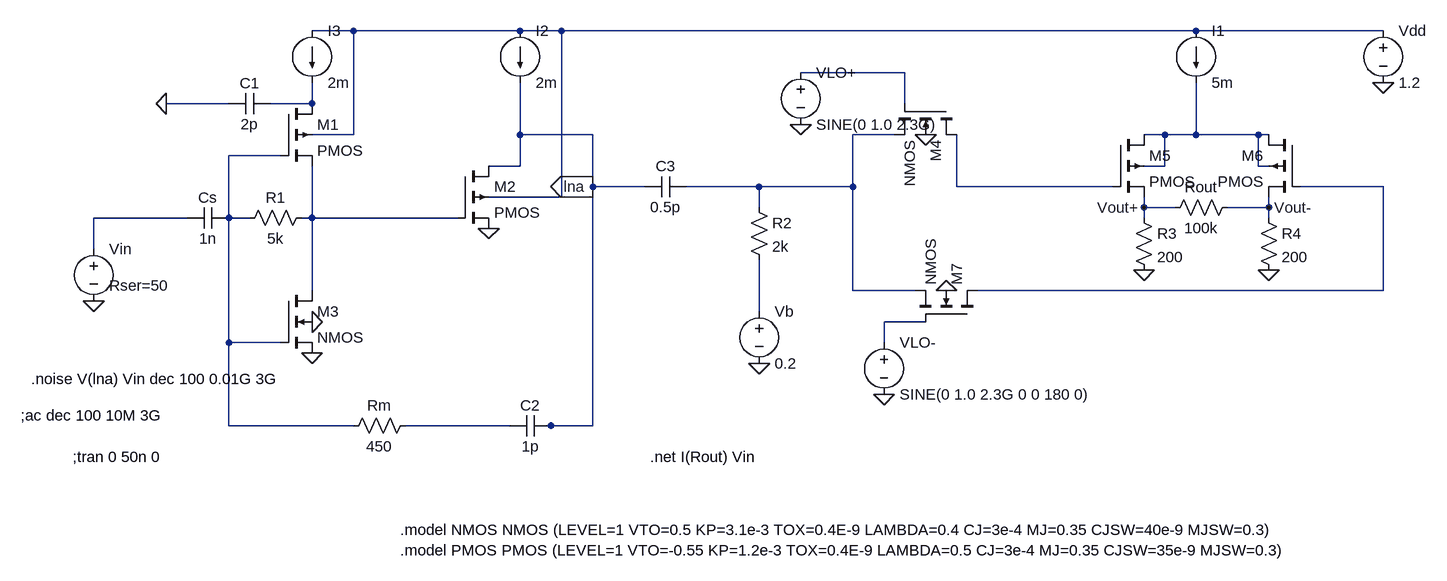
[diagram p0: schematic grad_noise.asc]
grad_noise.asc, the LTspice schematic file:
Version 4
SHEET 1 880 884
WIRE -912 48 -976 48
WIRE -656 48 -912 48
WIRE -592 48 -656 48
WIRE 384 48 -592 48
WIRE 672 48 384 48
WIRE -64 112 -224 112
WIRE -1104 160 -1200 160
WIRE -976 160 -976 128
WIRE -976 160 -1040 160
WIRE -64 160 -64 112
WIRE -912 208 -912 48
WIRE -912 208 -976 208
WIRE -656 208 -656 128
WIRE -544 208 -656 208
WIRE -80 208 -144 208
WIRE 336 208 304 208
WIRE 384 208 384 128
WIRE 384 208 336 208
WIRE 480 208 384 208
WIRE 496 208 480 208
WIRE -1024 240 -1104 240
WIRE -656 256 -656 208
WIRE -656 256 -704 256
WIRE 336 256 336 208
WIRE 336 256 304 256
WIRE 480 256 480 208
WIRE 496 256 480 256
WIRE -544 288 -544 208
WIRE -464 288 -544 288
WIRE -288 288 -400 288
WIRE -144 288 -144 208
WIRE -144 288 -288 288
WIRE 16 288 16 208
WIRE 256 288 16 288
WIRE 672 288 544 288
WIRE -592 304 -592 48
WIRE -592 304 -704 304
WIRE -288 320 -288 288
WIRE 304 320 304 304
WIRE 352 320 304 320
WIRE 496 320 496 304
WIRE 496 320 432 320
WIRE -1168 336 -1312 336
WIRE -1104 336 -1104 240
WIRE -1072 336 -1104 336
WIRE -976 336 -976 256
WIRE -976 336 -992 336
WIRE -752 336 -976 336
WIRE 304 336 304 320
WIRE 496 336 496 320
WIRE -1312 384 -1312 336
WIRE -976 448 -976 336
WIRE -144 448 -144 288
WIRE -48 448 -144 448
WIRE 672 448 672 288
WIRE 672 448 48 448
WIRE -288 480 -288 400
WIRE -32 496 -96 496
WIRE -1104 528 -1104 336
WIRE -1024 528 -1104 528
WIRE -96 528 -96 496
WIRE -1104 656 -1104 528
WIRE -912 656 -1104 656
WIRE -672 656 -832 656
WIRE -608 656 -624 656
WIRE -544 656 -544 288
WIRE -544 656 -608 656
FLAG 672 128 0
FLAG -1200 160 0
FLAG -704 352 0
FLAG -976 496 0
FLAG -976 544 0
FLAG -1312 464 0
FLAG -32 208 0
FLAG -224 192 0
FLAG -96 608 0
FLAG 304 416 0
FLAG 496 416 0
FLAG -288 560 0
FLAG 0 448 0
FLAG 304 320 Vout+
FLAG 496 320 Vout-
FLAG -544 288 lna
IOPIN -544 288 Out
SYMBOL voltage 672 32 R0
WINDOW 123 0 0 Left 0
WINDOW 39 0 0 Left 0
SYMATTR InstName Vdd
SYMATTR Value 1.2
SYMBOL current 384 48 R0
WINDOW 123 0 0 Left 0
WINDOW 39 0 0 Left 0
SYMATTR InstName I1
SYMATTR Value 5m
SYMBOL current -656 48 R0
WINDOW 123 0 0 Left 0
WINDOW 39 0 0 Left 0
SYMATTR InstName I2
SYMATTR Value 2m
SYMBOL current -976 48 R0
WINDOW 123 0 0 Left 0
WINDOW 39 0 0 Left 0
SYMATTR InstName I3
SYMATTR Value 2m
SYMBOL cap -1040 144 R90
WINDOW 0 0 32 VBottom 2
WINDOW 3 32 32 VTop 2
SYMATTR InstName C1
SYMATTR Value 2p
SYMBOL pmos4 -1024 160 R0
SYMATTR InstName M1
SYMATTR Value2 l=180n w=144u
SYMBOL res -976 320 R90
WINDOW 0 0 56 VBottom 2
WINDOW 3 32 56 VTop 2
SYMATTR InstName R1
SYMATTR Value 5k
SYMBOL pmos4 -752 256 R0
SYMATTR InstName M2
SYMATTR Value2 l=180n w=14.4u
SYMBOL nmos4 -1024 448 R0
SYMATTR InstName M3
SYMATTR Value2 l=180n w=5.4u
SYMBOL res -816 640 R90
WINDOW 0 0 56 VBottom 2
WINDOW 3 32 56 VTop 2
SYMATTR InstName Rm
SYMATTR Value 450
SYMBOL cap -608 640 R90
WINDOW 0 0 32 VBottom 2
WINDOW 3 32 32 VTop 2
SYMATTR InstName C2
SYMATTR Value 1p
SYMBOL cap -400 272 R90
WINDOW 0 0 32 VBottom 2
WINDOW 3 32 32 VTop 2
SYMATTR InstName C3
SYMATTR Value 0.5p
SYMBOL res -304 304 R0
SYMATTR InstName R2
SYMATTR Value 2k
SYMBOL cap -1104 320 R90
WINDOW 0 0 32 VBottom 2
WINDOW 3 32 32 VTop 2
SYMATTR InstName Cs
SYMATTR Value 1n
SYMBOL nmos4 16 160 R90
SYMATTR InstName M4
SYMATTR Value2 l=180n w=900n
SYMBOL voltage -224 96 R0
WINDOW 123 0 0 Left 0
WINDOW 39 0 0 Left 0
SYMATTR InstName VLO+
SYMATTR Value SINE(0 1.0 2.3G)
SYMBOL voltage -96 512 R0
WINDOW 123 0 0 Left 0
WINDOW 39 0 0 Left 0
SYMATTR InstName VLO-
SYMATTR Value SINE(0 1.0 2.3G 0 0 180 0)
SYMBOL pmos4 256 208 R0
SYMATTR InstName M5
SYMATTR Value2 l=180n w=15u
SYMBOL pmos4 544 208 M0
SYMATTR InstName M6
SYMATTR Value2 l=180n w=15u
SYMBOL nmos4 48 496 M270
SYMATTR InstName M7
SYMATTR Value2 l=180n w=900n
SYMBOL res 288 320 R0
SYMATTR InstName R3
SYMATTR Value 200
SYMBOL res 480 320 R0
SYMATTR InstName R4
SYMATTR Value 200
SYMBOL voltage -288 464 R0
WINDOW 123 0 0 Left 0
WINDOW 39 0 0 Left 0
SYMATTR InstName Vb
SYMATTR Value 0.2
SYMBOL voltage -1312 368 R0
WINDOW 3 24 152 Left 2
WINDOW 123 24 44 Left 2
WINDOW 39 24 72 Left 2
SYMATTR Value ""
SYMATTR SpiceLine Rser=50
SYMATTR InstName Vin
SYMBOL res 448 304 R90
WINDOW 0 0 56 VBottom 2
WINDOW 3 32 56 VTop 2
SYMATTR InstName Rout
SYMATTR Value 100k
TEXT -1344 704 Left 2 !;tran 0 50n 0
TEXT -840 816 Left 2 !.model NMOS NMOS (LEVEL=1 VTO=0.5 KP=3.1e-3 TOX=0.4E-9 LAMBDA=0.4 CJ=3e-4 MJ=0.35 CJSW=40e-9 MJSW=0.3)
TEXT -840 848 Left 2 !.model PMOS PMOS (LEVEL=1 VTO=-0.55 KP=1.2e-3 TOX=0.4E-9 LAMBDA=0.5 CJ=3e-4 MJ=0.35 CJSW=35e-9 MJSW=0.3)
TEXT -456 704 Left 2 !.net I(Rout) Vin
TEXT -1424 640 Left 2 !;ac dec 100 10M 3G
TEXT -1408 584 Left 2 !.noise V(lna) Vin dec 100 0.01G 3G

The netlist it stands for:
* grad_noise.asc
Vdd N001 0 1.2
I1 N001 N005 5m
I2 N001 lna 2m
I3 N001 N003 2m
C1 N003 0 2p
M1 N003 N006 N010 N001 PMOS l=180n w=144u
R1 N010 N006 5k
M2 lna N010 0 N001 PMOS l=180n w=14.4u
M3 N010 N006 0 0 NMOS l=180n w=5.4u
Rm N013 N006 450
C2 lna N013 1p
C3 N004 lna 0.5p
R2 N004 N011 2k
Cs N006 N009 1n
M4 N007 N002 N004 0 NMOS l=180n w=900n
VLO+ N002 0 SINE(0 1.0 2.3G)
VLO- N012 0 SINE(0 1.0 2.3G 0 0 180 0)
M5 N005 N007 Vout+ N005 PMOS l=180n w=15u
M6 N005 N008 Vout- N005 PMOS l=180n w=15u
M7 N008 N012 N004 0 NMOS l=180n w=900n
R3 Vout+ 0 200
R4 Vout- 0 200
Vb N011 0 0.2
Vin N009 0 Rser=50
Rout Vout- Vout+ 100k
.model NMOS NMOS
.model PMOS PMOS
.lib standard.mos
;tran 0 50n 0
.model NMOS NMOS (LEVEL=1 VTO=0.5 KP=3.1e-3 TOX=0.4E-9 LAMBDA=0.4 CJ=3e-4 MJ=0.35 CJSW=40e-9 MJSW=0.3)
.model PMOS PMOS (LEVEL=1 VTO=-0.55 KP=1.2e-3 TOX=0.4E-9 LAMBDA=0.5 CJ=3e-4 MJ=0.35 CJSW=35e-9 MJSW=0.3)
.net I(Rout) Vin
;ac dec 100 10M 3G
.noise V(lna) Vin dec 100 0.01G 3G
.backanno
.end